# EasyEDA Pro project ProPrj_table-monitor_2025-05-22.epro, board PCB1
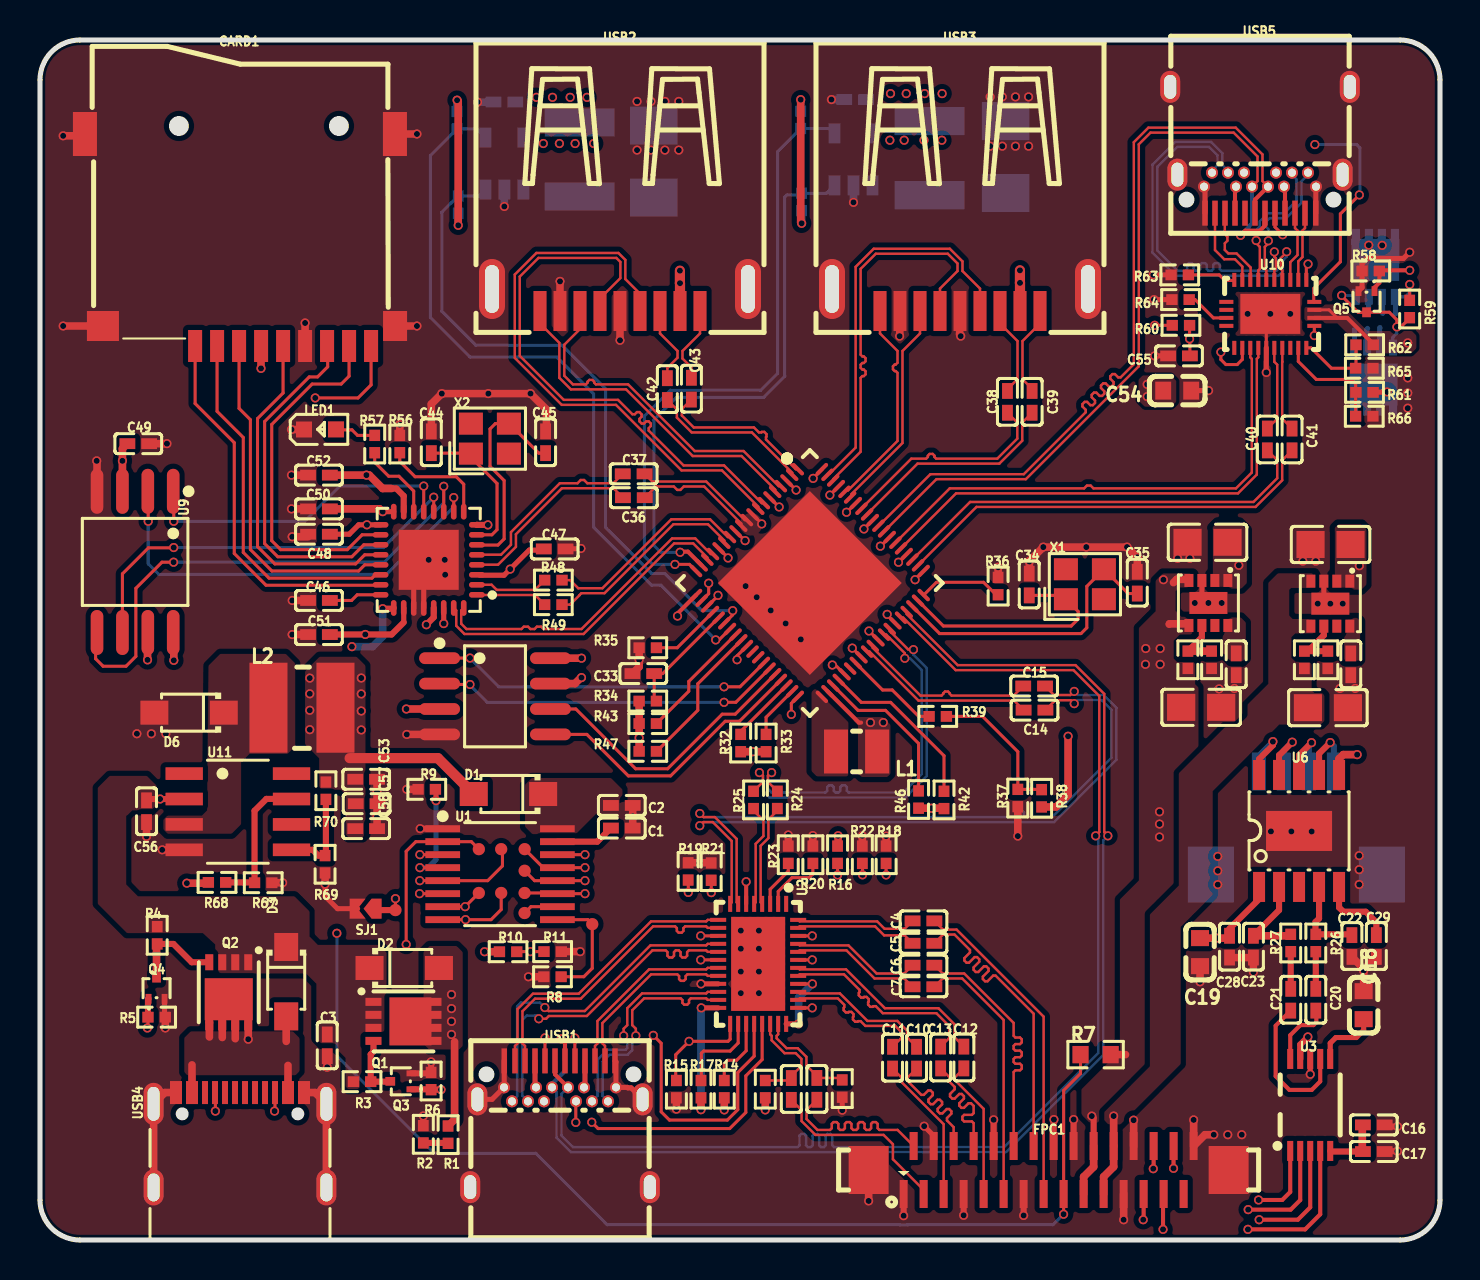
[diagram p5: board, top side]
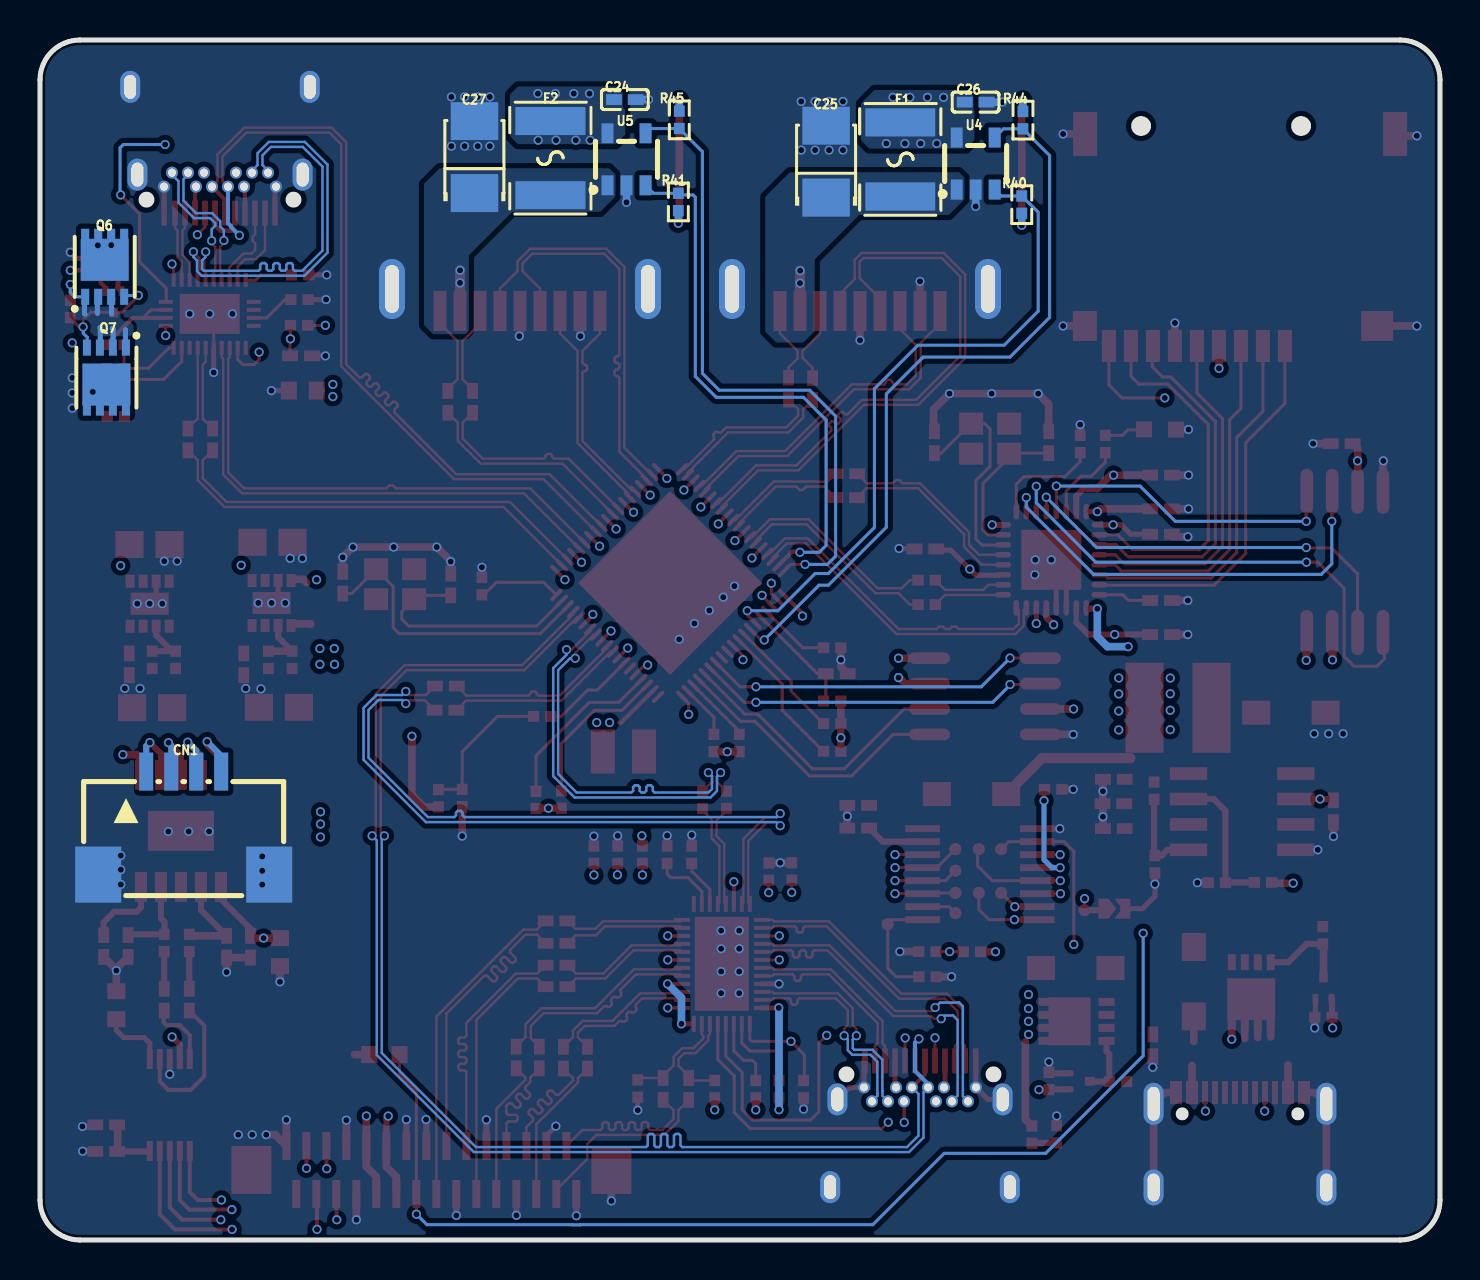
[diagram p6: board, bottom side, seen from below]

Outline 70 x 60 mm; copper layers: Top Layer, GND, VCC, Bottom Layer. Coordinates in mm from the lower left corner of the outline.
Outline path: 0,58 0,2 arc(0.59,0.59) 2,0 68,0 arc(69.41,0.59) 70,2 70,58 arc(69.41,59.41) 68,60 2,60 arc(0.59,59.41) 0,58
Stack: Top Layer 0.035mm 外层铜厚1oz / Dielectric1 0.2104mm 7628 RC49% 8.6mil / GND 0.0152mm 内层铜厚 / Dielectric2 1.065mm 1.1mm H/HOZ Copper / VCC 0.0152mm 内层铜厚 / Dielectric3 0.2104mm 7628 RC49% 8.6mil / Bottom Layer 0.035mm 外层铜厚1oz

## Design rules (mm)
net 0_IN0_P: 0_IN0_
net LANE0_P: LANE0_
net 0_IN0_N: 0_IN0_
net LANE0_N: LANE0_
net 0_IN1_P: 0_IN1_
net LANE1_P: LANE1_
net 0_IN1_N: 0_IN1_
net LANE1_N: LANE1_
net 0_AUX_N: 0_AUX_P
net AUX_N: AUX_
net 0_AUX_P: 0_AUX_P
net AUX_P: AUX_
net 0_IN3_P: 0_IN3_
net LANE3_P: LANE3_
net 0_IN3_N: 0_IN3_
net LANE3_N: LANE3_
net 0_IN2_P: 0_IN2_
net LANE2_P: LANE2_
net 0_IN2_N: 0_IN2_
net LANE2_N: LANE2_
net 0_SSTX_N: 0_SSTX_
net 0_SSTX_P: 0_SSTX_
net SS_TX4_N: SS_TX4_
net SS_TX4_P: SS_TX4_
net SS_TX2_N: SS_TX2_
net SS_TX2_P: SS_TX2_
net SS_TX3_N: SS_TX3_
net SS_TX3_P: SS_TX3_
net SS_TX1_N: SS_TX1_
net SS_TX1_P: SS_TX1_
net SD_D1: SD
net SD_D0: SD
net SD_CLK: SD
net SD_CMD: SD
net SD_D3: SD
net SD_D2: SD
net 0_SSRX_N: 0_SSRX_
net 0_SSRX_P: 0_SSRX_
net SS_RX4_P: SS_RX4_
net SS_RX4_N: SS_RX4_
net C0_TX1_N: C0_TX1_
net C0_TX1_P: C0_TX1_
net C0_RX2_P: C0_RX2_
net C0_RX2_N: C0_RX2_
net C0_RX1_P: C0_RX1_
net C0_RX1_N: C0_RX1_
net C0_TX2_N: C0_TX2_
net C0_TX2_P: C0_TX2_
net SS_HS4_N: SS_HS4_
net SS_HS4_P: SS_HS4_
net C3_RX2_P: C3_RX2_
net C3_RX2_N: C3_RX2_
net C3_RX1_N: C3_RX1_
net C3_RX1_P: C3_RX1_
net C3_TX2_P: C3_TX2_
net C3_TX2_N: C3_TX2_
net C3_TX1_N: C3_TX1_
net C3_TX1_P: C3_TX1_
net SS_HS2_N: SS_HS2_
net SS_HS2_P: SS_HS2_
net SS_HS3_N: SS_HS3_
net SS_HS3_P: SS_HS3_
net C0_DM: U_U2
net C0_DP: U_U2
net SS_HS1_N: SS_HS1_
net SS_HS1_P: SS_HS1_
net 0#SSTX_N: 0#SSTX_
net 0#SSTX_P: 0#SSTX_
net 0#SSRX_N: 0#SSRX_
net 0#SSRX_P: 0#SSRX_
net #SS_TX4_N: #SS_TX4_
net #SS_TX4_P: #SS_TX4_
net #SS_TX2_N: #SS_TX2_
net #SS_TX2_P: #SS_TX2_
net #SS_TX3_N: #SS_TX3_
net #SS_TX3_P: #SS_TX3_
net #SS_TX1_N: #SS_TX1_
net #SS_TX1_P: #SS_TX1_
net #SS_RX4_P: #SS_RX4_
net #SS_RX4_N: #SS_RX4_
net #SS_RX3_P: #SS_RX3_
net #SS_RX3_N: #SS_RX3_
net #SS_RX2_N: #SS_RX2_
net #SS_RX2_P: #SS_RX2_
net #SS_RX1_N: #SS_RX1_
net #SS_RX1_P: #SS_RX1_
template: 自定义配置
spacing copperThickness1oz (default): track to track 0.203, other pairs 0.152 to 0.3
spacing copperThickness2oz: track to track 0.203, other pairs 0.152 to 0.3
track width copperThickness1oz (default): min 0.102, default 0.152, max 2.54
track width copperThickness2oz: min 0.203, default 0.254, max 2.54
differential pair differentialPair (default): width min 0.089, default 0.122, max 2.54; gap min 0.127, default 0.127
via viaSize (default): diameter min 0.457, default 0.457, max 10; hole min 0.3, default 0.305, max 6.299
net GND uses copperThickness2oz

## Placement (name value [footprint] x y rotation side)
C1  1uF  [C0402]  29.09 20.6 180 top
C2  0.1uF  [C0402]  29.09 21.73 180 top
C3  10uF  [C0402]  14.36 9.73 90 top
C4  0.1uF  [C0402]  44.17 15.96 0 top
C5  0.1uF  [C0402]  44.17 14.83 0 top
C6  0.1uF  [C0402]  44.17 13.74 0 top
C7  0.1uF  [C0402]  44.17 12.66 0 top
C8  0.1uF  [C0402]  38.84 7.56 270 top
C9  0.1uF  [C0402]  37.57 7.55 270 top
C10  0.1uF  [C0402]  43.83 9.12 270 top
C11  0.1uF  [C0402]  42.63 9.12 270 top
C12  0.1uF  [C0402]  46.19 9.12 270 top
C13  0.1uF  [C0402]  45.03 9.12 270 top
C14  0.1uF  [C0402]  49.73 26.49 180 top
C15  0.1uF  [C0402]  49.71 27.7 180 top
C16  0.1uF  [C0402]  66.69 5.75 180 top
C17  10uF  [C0402]  66.69 4.42 180 top
C18  10uF  [C0603]  66.18 11.74 270 top
C19  1uF  [C0603]  58 14.39 90 top
C20  10uF  [C0402]  63.79 12.01 90 top
C21  10uF  [C0402]  62.54 12.01 90 top
C22  470pF/NC  [C0402]  65.59 14.7 270 top
C23  470pF/NC  [C0402]  60.67 14.67 90 top
C24  100nF  [C0402]  40.76 57.02 0 bottom
C25  47uF  [CAP-SMD_L3.5-W2.8-FD]  30.7 53.92 90 bottom
C26  100nF  [C0402]  23.22 56.89 0 bottom
C27  47uF  [CAP-SMD_L3.5-W2.8-FD]  48.28 54.15 90 bottom
C28  0.1uF  [C0402]  59.48 14.67 90 top
C29  1uF  [C0402]  66.82 14.7 90 top
C30  3.3nF  [C0402]  65.54 28.78 270 top
C31  22uF  [C0805]  64.39 26.62 180 top
C32  10uF  [C0805]  64.53 34.78 180 top
C33  1uF  [C0402]  30.16 28.32 0 top
C34  20pF  [C0402]  49.46 32.77 90 top
C35  20pF  [C0402]  54.86 32.87 90 top
C36  01.uF  [C0402]  29.69 37.12 0 top
C37  0.1uF  [C0402]  29.68 38.31 0 top
C38  0.1uF  [C0402]  48.37 41.91 90 top
C39  0.1uF  [C0402]  49.6 41.91 90 top
C40  0.1uF  [C0402]  61.37 40.03 90 top
C41  0.1uF  [C0402]  62.6 40.03 90 top
C42  0.1uF  [C0402]  31.37 42.55 270 top
C43  0.1uF  [C0402]  32.57 42.57 270 top
C44  22pF  [C0402]  19.57 39.89 270 top
C45  20pF  [C0402]  25.28 39.89 270 top
C46  0.1uF  [C0402]  13.95 31.98 0 top
C47  0.1uF  [C0402]  25.73 34.55 180 top
C48  0.1uF  [C0402]  13.95 35.29 0 top
C49  0.1uF  [C0402]  4.91 39.82 180 top
C50  0.1uF  [C0402]  13.95 36.56 0 top
C51  4.7uF  [C0402]  13.95 30.27 0 top
C52  2.2uF  [C0402]  13.95 38.24 0 top
C53  0.1uF  [C0402]  16.31 23.04 0 top
C54  1uF  [C0603]  56.86 42.47 180 top
C55  0.1uF  [C0402]  56.95 44.21 0 top
C56  0.1uF  [C0402]  5.33 21.44 90 top
C57  0.1uF  [C0402]  16.33 21.82 180 top
C58  22uF  [C0402]  16.31 20.57 180 top
C59  3.3nF  [C0402]  59.81 28.79 270 top
C60  22uF  [C0805]  58.06 26.63 180 top
C61  10uF  [C0805]  58.38 34.89 0 top
CARD1  TF-01A  [TF-SMD_TF-02]  10 50 180 top
CN1  WAFER-MX1.25-4PCB  [CONN-SMD_4P-P1.25_A1253WR-S-04PD01]  62.81 20.84 180 bottom
D1  S34  [SOD-123FL_L2.7-W1.8-LS3.8-RD]  23.42 22.3 180 top
D2  S34  [SOD-123FL_L2.7-W1.8-LS3.8-RD]  18.21 13.6 0 top
D3  S34  [SOD-123FL_L2.7-W1.8-LS3.8-RD]  12.31 12.92 270 top
D6  S34  [SOD-123FL_L2.7-W1.8-LS3.8-RD]  7.45 26.37 180 top
F1  -  [F1812]  26.98 54.03 270 bottom
F2  -  [F1812]  44.48 54.09 270 bottom
FPC1  AFC11-S30ICA-00  [CONN-SMD-30P_AFC11-S30ICA-00]  50.43 3.5 0 top
L1  4.7uH  [IND-SMD_L2.5-W2.0]  40.83 24.43 180 top
L2  2.2uH  [IND-SMD_L4.5-W4.0_SCD0403T]  13.1 26.61 0 top
LED1  -  [LED_0603]  14.05 40.53 0 top
NOREF  -  [Pad_e954]  21.94 19.54 0 top
NOREF#2  -  [Pad_e956]  24.23 19.54 0 top
NOREF#3  -  [Pad_e958]  24.23 17.35 0 top
NOREF#4  -  [Pad_e960]  23.06 17.35 0 top
NOREF#5  -  [Pad_e961]  21.94 17.35 0 top
NOREF#6  -  [Pad_e962]  17.77 16.5 0 top
NOREF#7  -  [Pad_e955]  23.06 19.54 0 top
NOREF#8  -  [Pad_e957]  24.23 18.46 0 top
NOREF#9  -  [Pad_e959]  24.23 16.35 0 top
NOREF#10  -  [Pad_e997]  27.61 15.79 0 top
Q1  AON7409  [DFN-8_L3.0-W3.0-P0.65-BL]  18.17 10.93 270 top
Q2  AON7409  [DFN-8_L3.0-W3.0-P0.65-BL]  9.44 12.39 180 top
Q3  2SK3541MGT2L  [SOT-723-3_L1.2-W0.8-P0.80-LS1.2-BR]  18.04 7.93 0 top
Q4  2SK3541MGT2L  [SOT-723-3_L1.2-W0.8-P0.80-LS1.2-BR]  5.83 12.59 270 top
Q5  2SK3541MGT2L  [SOT-723-3_L1.2-W0.8-P0.80-LS1.2-BR]  66.33 46.91 90 top
Q6  AON7409  [DFN-8_L3.0-W3.0-P0.65-BL]  66.76 48.66 180 bottom
Q7  AON7409  [DFN-8_L3.0-W3.0-P0.65-BL]  66.68 43.12 0 bottom
R1  NC  [R0402]  20.4 5.27 90 top
R2  NC  [R0402]  19.17 5.29 270 top
R3  100K  [R0402]  16.1 7.92 180 top
R4  100K  [R0402]  5.86 15.24 90 top
R5  10K  [R0402]  5.83 11.14 180 top
R6  10K  [R0402]  19.56 7.95 270 top
R7  1K  [R0603]  52.78 9.27 180 top
R8  10K  [R0402]  25.62 13.16 180 top
R9  NC  [R0402]  19.34 22.53 180 top
R10  36K  [R0402]  23.41 14.41 180 top
R11  12K  [R0402]  25.63 14.42 180 top
R12  1M  [R0402]  36.26 7.54 270 top
R13  1M  [R0402]  40.11 7.57 270 top
R14  10K  [R0402]  34.21 7.54 90 top
R15  10K  [R0402]  31.82 7.54 90 top
R16  10K  [R0402]  39.88 19.26 270 top
R17  10K  [R0402]  33.05 7.54 90 top
R18  20K  [R0402]  42.31 19.26 90 top
R19  0R  [R0402]  32.41 18.43 90 top
R20  20K  [R0402]  38.64 19.26 90 top
R21  0R  [R0402]  33.56 18.42 90 top
R22  0R  [R0402]  41.12 19.26 90 top
R23  0R  [R0402]  37.41 19.26 90 top
R24  0R  [R0402]  36.87 22 90 top
R25  0R  [R0402]  35.68 22 90 top
R26  470R  [R0402]  63.79 14.85 90 top
R27  470R  [R0402]  62.54 14.85 90 top
R30  47K  [R0402]  63.22 29.01 270 top
R31  91K  [R0402]  64.39 29.01 90 top
R32  10K  [R0402]  35.03 24.85 90 top
R33  10K  [R0402]  36.3 24.85 90 top
R34  10K  [R0402]  30.39 26.95 180 top
R35  4.7K  [R0402]  30.39 29.61 0 top
R36  6.04K  [R0402]  47.91 32.7 90 top
R37  10K  [R0402]  48.89 22.1 90 top
R38  4.7K  [R0402]  50.08 22.09 270 top
R39  100K  [R0402]  44.89 26.18 180 top
R40  10K  [R0402]  20.91 51.77 90 bottom
R41  10K  [R0402]  38.08 51.9 90 bottom
R42  10K  [R0402]  43.93 22.02 270 top
R43  10K  [R0402]  30.39 25.82 0 top
R44  10K  [R0402]  20.85 55.99 270 bottom
R45  10K  [R0402]  38.03 56.01 270 bottom
R46  10K  [R0402]  45.2 22 270 top
R47  10K  [R0402]  30.39 24.43 0 top
R48  0R  [R0402]  25.67 32.99 0 top
R49  0R  [R0402]  25.67 31.77 0 top
R56  680R  [R0402]  17.99 39.8 270 top
R57  1K  [R0402]  16.73 39.8 270 top
R58  10K  [R0402]  66.54 48.45 0 top
R59  10K  [R0402]  68.48 46.55 90 top
R60  10K  [R0402]  57.05 45.73 180 top
R61  10K  [R0402]  66.23 42.39 0 top
R62  NC  [R0402]  66.23 44.76 0 top
R63  20.5K  [R0402]  56.99 48.26 180 top
R64  10K  [R0402]  57.03 47.02 180 top
R65  10K  [R0402]  66.22 43.59 180 top
R66  10K  [R0402]  66.21 41.19 180 top
R67  100K  [R0402]  11.16 17.86 180 top
R68  100K  [R0402]  8.85 17.88 180 top
R69  2K  [R0402]  14.25 18.79 90 top
R70  6K2  [R0402]  14.3 22.46 90 top
R71  47K  [R0402]  57.39 29.01 270 top
R72  15K  [R0402]  58.58 29.01 90 top
SJ1  -  [TOGO_MODE]  16.28 16.57 180 top
U1  LDR6023B  [SSOP-16_L5.0-W4.4-P0.65-LS6.4-BL]  23 18.29 270 top
U2  TUSB1064RNQT  [WQFN-40_L6.0-W4.0-P0.40-TL-EP]  35.91 13.81 270 top
U3  CS4344  [TSSOP-10_L3.0-W3.0-P0.50-LS4.9-BL]  63.51 6.75 0 top
U4  SY6288CAAC  [SOT-23-5_L3.0-W1.7-P0.95-LS2.8-BR]  23.22 53.82 270 bottom
U5  SY6288CAAC  [SOT-23-5_L3.0-W1.7-P0.95-LS2.8-BR]  40.67 54.03 270 bottom
U6  LTK5208  [ESOP-10_L4.9-W3.9-P1.00-LS6.1-BL-EP]  62.95 20.45 0 top
U7  TPS82130SILR  [USIP-8_L3.0-W2.8-P0.65-TL-EP]  64.52 31.82 270 top
U8  GL3224-OIY04  [HQFN-32_L5.0-W5.0-P0.50-BL-EP3.0]  19.44 34.01 90 top
U9  W25Q80DVSSIG  [SOIC-8_L5.3-W5.3-P1.27-LS8.0-BL]  4.76 33.9 180 top
U10  VL160  [MQFN-28_L4.5-W3.5-P0.40-BL-EP]  61.52 46.31 180 top
U11  TD1583  [SOP-8_L4.9-W3.9-P1.27-LS6.0-BL]  9.89 21.41 270 top
U13  VL817-Q7(C0)  [QFN-76_L9.0-W9.0-P0.40-EP6.3-TL]  38.49 32.85 315 top
U14  W25Q80DVSSIG  [SOIC-8_L4.9-W3.9-P1.27-LS6.0-BL]  22.75 27.19 270 top
U17  TPS82130SILR  [USIP-8_L3.0-W2.8-P0.65-TL-EP]  58.42 31.85 270 top
USB1  TYPE-C 24P QCHT  [TYPE-C-SMD_TYPE-C-24P-QCHT#2]  26 5.8 0 top
USB2  U-A-39DS-Y-1  [USB-3.0-SMD_U-A-39DS-Y-1]  29 47 180 top
USB3  U-A-39DS-Y-1  [USB-3.0-SMD_U-A-39DS-Y-1]  46 47 180 top
USB4  TYPEC-304A-ACP16O  [USB-SMD_TYPEC-304A-ACP16O]  10 5 0 top
USB5  HX TYPE-C 24P QCHT  [TYPE-C-SMD_TYPE-C-24P-QCHT]  61 54.5 180 top
X1  25MHz  [CRYSTAL-SMD_4P-L2.5-W2.0-BL]  52.25 32.79 0 top
X2  25MHz  [CRYSTAL-SMD_4P-L2.5-W2.0-BL]  22.5 40.07 0 top

## Footprints (pads in the part's own frame, mm; a bottom-side part is the same pattern mirrored in y, then rotated)
C0402
  rect 0.79x0.54 smd: 1(-0.545,0) 2(0.545,0)
C0603
  rect 0.8x0.9 smd: 1(-0.7,0) 2(0.7,0)
C0805
  rect 1.41x1.35 smd: 1(-1,0) 2(1,0)
CAP-SMD_L3.5-W2.8-FD
  rect 1.9x2.376 smd: 1(-1.798,0) 2(1.798,0)
CONN-SMD-30P_AFC11-S30ICA-00
  rect 0.4x1.4 smd: 1(-7.25,-1.2) 2(-6.75,1.2) 3(-6.25,-1.2) 4(-5.75,1.2) 5(-5.25,-1.2) 6(-4.75,1.2) 7(-4.25,-1.2) 8(-3.75,1.2) 9(-3.25,-1.2) 10(-2.75,1.2) 11(-2.25,-1.2) 12(-1.75,1.2) 13(-1.25,-1.2) 14(-0.75,1.2) 15(-0.25,-1.2) 16(0.25,1.2) 17(0.75,-1.2) 18(1.25,1.2) 19(1.75,-1.2) 20(2.25,1.2) 21(2.75,-1.2) 22(3.25,1.2) 23(3.75,-1.2) 24(4.25,1.2) 25(4.75,-1.2) 26(5.25,1.2) 27(5.75,-1.2) 28(6.25,1.2) 29(6.75,-1.2) 30(7.25,1.2)
  rect 2x2.4 smd: 31(9,0) 32(-9,0)
CONN-SMD_4P-P1.25_A1253WR-S-04PD01
  rect 0.7x1.9 smd: 1(-1.875,2.575) 2(-0.625,2.575) 3(0.625,2.575) 4(1.875,2.575)
  rect 2.3x2.8 smd: 5(4.275,-2.575) 6(-4.275,-2.575)
CRYSTAL-SMD_4P-L2.5-W2.0-BL
  rect 1.2x1.1 smd: 1(-0.95,-0.75) 2(0.95,-0.75) 3(0.95,0.75) 4(-0.95,0.75)
DFN-8_L3.0-W3.0-P0.65-BL
  rect 0.4x0.8 smd: 1(-0.975,-1.5) 2(-0.325,-1.5) 3(0.325,-1.5) 4(0.975,-1.5) 5(0.975,1.5) 6(0.325,1.5) 7(-0.325,1.5) 8(-0.975,1.5)
  rect 2.4x2.1 smd: 9(0,0.35)
ESOP-10_L4.9-W3.9-P1.00-LS6.1-BL-EP
  rect 0.6x1.5 smd: 1(-2,-2.8) 2(-1,-2.8) 3(0,-2.8) 4(1,-2.8) 5(2,-2.8) 6(2,2.8) 7(1,2.8) 8(0,2.8) 9(-1,2.8) 10(-2,2.8)
  rect 3.3x2 smd: 11(0,0)
F1812
  rect 1.407x3.499 smd: 1(-1.853,0) 2(1.853,0)
HQFN-32_L5.0-W5.0-P0.50-BL-EP3.0
  oval 0.28x0.785 smd: 1(-1.75,-2.408) 2(-1.25,-2.408) 3(-0.75,-2.408) 4(-0.25,-2.408) 5(0.25,-2.408) 6(0.75,-2.408) 7(1.25,-2.408) 8(1.75,-2.408) 17(1.75,2.408) 18(1.25,2.408) 19(0.75,2.408) 20(0.25,2.408) 21(-0.25,2.408) 22(-0.75,2.408) 23(-1.25,2.408) 24(-1.75,2.408)
  oval 0.785x0.28 smd: 9(2.408,-1.75) 10(2.408,-1.25) 11(2.408,-0.75) 12(2.408,-0.25) 13(2.408,0.25) 14(2.408,0.75) 15(2.408,1.25) 16(2.408,1.75) 25(-2.408,1.75) 26(-2.408,1.25) 27(-2.408,0.75) 28(-2.408,0.25) 29(-2.408,-0.25) 30(-2.408,-0.75) 31(-2.408,-1.25) 32(-2.408,-1.75)
  rect 3x3 smd: 33(0,0)
IND-SMD_L2.5-W2.0
  rect 1.2x2.2 smd: 1(1.028,0) 2(-1.028,0)
IND-SMD_L4.5-W4.0_SCD0403T
  rect 1.9x4.5 smd: 1(-1.675,0) 2(1.675,0)
LED_0603
  rect 0.8x0.8 smd: 1(-0.851,-0.01) 2(0.75,-0.005)
MQFN-28_L4.5-W3.5-P0.40-BL-EP
  rect 0.201x0.701 smd: 1(-1.801,-1.7) 2(-1.399,-1.7) 3(-1.001,-1.7) 4(-0.6,-1.7) 5(-0.201,-1.7) 6(0.201,-1.7) 7(0.6,-1.7) 8(1.001,-1.7) 9(1.399,-1.7) 10(1.801,-1.7) 15(1.801,1.7) 16(1.399,1.7) 17(1.001,1.7) 18(0.6,1.7) 19(0.201,1.7) 20(-0.201,1.7) 21(-0.6,1.7) 22(-1.001,1.7) 23(-1.399,1.7) 24(-1.801,1.7)
  rect 0.701x0.201 smd: 11(2.2,-0.6) 12(2.2,-0.201) 13(2.2,0.201) 14(2.2,0.6) 25(-2.2,0.6) 26(-2.2,0.201) 27(-2.2,-0.201) 28(-2.2,-0.6)
  rect 2.999x1.999 smd: 29(0,0)
Pad_e954
  round 0.61 smd: TP1(0,0)
Pad_e955
  round 0.61 smd: TP2(0,0)
Pad_e956
  round 0.61 smd: TP3(0,0)
Pad_e957
  round 0.61 smd: TP4(0,0)
Pad_e958
  round 0.61 smd: TP5(0,0)
Pad_e959
  round 0.61 smd: TP6(0,0)
Pad_e960
  round 0.61 smd: TP7(0,0)
Pad_e961
  round 0.61 smd: TP8(0,0)
Pad_e962
  round 0.61 smd: TP9(0,0)
Pad_e997
  round 0.61 smd: TP10(0,0)
QFN-76_L9.0-W9.0-P0.40-EP6.3-TL
  oval 0.8x0.2 smd: 1(-4.45,3.599) 2(-4.45,3.2) 3(-4.45,2.799) 4(-4.45,2.401) 5(-4.45,1.999) 6(-4.45,1.6) 7(-4.45,1.199) 8(-4.45,0.8) 9(-4.45,0.399) 10(-4.45,0) 11(-4.45,-0.399) 12(-4.45,-0.8) 13(-4.45,-1.199) 14(-4.45,-1.6) 15(-4.45,-1.999) 16(-4.45,-2.401) 17(-4.45,-2.799) 18(-4.45,-3.2) 19(-4.45,-3.599) 39(4.45,-3.599) 40(4.45,-3.2) 41(4.45,-2.799) 42(4.45,-2.401) 43(4.45,-1.999) 44(4.45,-1.6) 45(4.45,-1.199) 46(4.45,-0.8) 47(4.45,-0.399) 48(4.45,0) 49(4.45,0.399) 50(4.45,0.8) 51(4.45,1.199) 52(4.45,1.6) 53(4.45,1.999) 54(4.45,2.401) 55(4.45,2.799) 56(4.45,3.2) 57(4.45,3.599)
  oval 0.2x0.8 smd: 20(-3.599,-4.45) 21(-3.2,-4.45) 22(-2.799,-4.45) 23(-2.401,-4.45) 24(-1.999,-4.45) 25(-1.6,-4.45) 26(-1.199,-4.45) 27(-0.8,-4.45) 28(-0.399,-4.45) 29(0,-4.45) 30(0.399,-4.45) 31(0.8,-4.45) 32(1.199,-4.45) 33(1.6,-4.45) 34(1.999,-4.45) 35(2.401,-4.45) 36(2.799,-4.45) 37(3.2,-4.45) 38(3.599,-4.45) 58(3.599,4.45) 59(3.2,4.45) 60(2.799,4.45) 61(2.401,4.45) 62(1.999,4.45) 63(1.6,4.45) 64(1.199,4.45) 65(0.8,4.45) 66(0.399,4.45) 67(0,4.45) 68(-0.399,4.45) 69(-0.8,4.45) 70(-1.199,4.45) 71(-1.6,4.45) 72(-1.999,4.45) 73(-2.401,4.45) 74(-2.799,4.45) 75(-3.2,4.45) 76(-3.599,4.45)
  rect 6.5x6.5 smd: 77(0,0)
R0402
  rect 0.566x0.54 smd: 1(-0.433,0) 2(0.433,0)
R0603
  rect 0.806x0.864 smd: 1(-0.753,0) 2(0.753,0)
SOD-123FL_L2.7-W1.8-LS3.8-RD
  rect 1.4x1.2 smd: 1(-1.735,0) 2(1.735,0)
SOIC-8_L4.9-W3.9-P1.27-LS6.0-BL
  oval 0.588x2.045 smd: 1(-1.905,-2.772) 2(-0.635,-2.772) 3(0.635,-2.772) 4(1.905,-2.772) 5(1.905,2.772) 6(0.635,2.772) 7(-0.635,2.772) 8(-1.905,2.772)
SOIC-8_L5.3-W5.3-P1.27-LS8.0-BL
  oval 0.63x2.25 smd: 1(-1.905,-3.53) 2(-0.635,-3.53) 3(0.635,-3.53) 4(1.905,-3.53) 5(1.905,3.53) 6(0.635,3.53) 7(-0.635,3.53) 8(-1.905,3.53)
SOP-8_L4.9-W3.9-P1.27-LS6.0-BL
  rect 0.63x1.865 smd: 1(-1.905,-2.683) 2(-0.635,-2.683) 3(0.635,-2.683) 4(1.905,-2.683) 5(1.905,2.683) 6(0.635,2.683) 7(-0.635,2.683) 8(-1.905,2.683)
SOT-23-5_L3.0-W1.7-P0.95-LS2.8-BR
  rect 1x0.6 smd: 1(1.3,-0.95) 2(1.3,0) 3(1.3,0.95) 4(-1.3,0.95) 5(-1.3,-0.95)
SOT-723-3_L1.2-W0.8-P0.80-LS1.2-BR
  rect 0.489x0.294 smd: 1(0.529,-0.4) 2(0.529,0.4)
  rect 0.489x0.434 smd: 3(-0.529,0)
SSOP-16_L5.0-W4.4-P0.65-LS6.4-BL
  rect 0.343x1.732 smd: 1(-2.275,-2.866) 2(-1.625,-2.866) 3(-0.975,-2.866) 4(-0.325,-2.866) 5(0.325,-2.866) 6(0.975,-2.866) 7(1.625,-2.866) 8(2.275,-2.866) 9(2.275,2.866) 10(1.625,2.866) 11(0.975,2.866) 12(0.325,2.866) 13(-0.325,2.866) 14(-0.975,2.866) 15(-1.625,2.866) 16(-2.275,2.866)
TF-SMD_TF-02
  rect 0.7x1.6 smd: 1(2.245,5.3) 2(1.145,5.3) 3(0.046,5.3) 4(-1.054,5.3) 5(-2.155,5.3) 6(-3.255,5.3) 7(-4.354,5.3) 8(-5.454,5.3) 9(-6.554,5.3)
  rect 1.2x1.5 smd: 10(-7.754,4.3)
  rect 1.2x2.2 smd: 11(-7.746,-5.3) 12(7.754,-5.3)
  rect 1.6x1.5 smd: 13(6.854,4.3)
TOGO_MODE
  custom 0.901x1 smd: 1(-0.35,0)
  custom 0.8x1 smd: 2(0.4,0)
TSSOP-10_L3.0-W3.0-P0.50-LS4.9-BL
  rect 0.299x1 smd: 1(-1,-2.3) 2(-0.5,-2.3) 3(0,-2.3) 4(0.5,-2.3) 5(1,-2.3) 6(1,2.3) 7(0.5,2.3) 8(0,2.3) 9(-0.5,2.3) 10(-1,2.3)
TYPE-C-SMD_TYPE-C-24P-QCHT
  oval 1x1.6 hole 0.6x1.2: 25(-4.49,-3.158) 25(-4.13,1.232) 25(4.13,1.232) 25(4.49,-3.158)
  rect 0.275x1.25 smd: A1(-2.79,3.158) A2(-2.25,3.158) A3(-1.75,3.158) A4(-1.25,3.158) A5(-0.75,3.158) A6(-0.25,3.158) A7(0.25,3.158) A8(0.75,3.158) A9(1.25,3.158) A10(1.75,3.158) A11(2.25,3.158) A12(2.75,3.158)
  round 0.6 hole 0.4: B1(2.8,1.833) B2(2.4,1.133) B3(1.601,1.133) B4(1.2,1.833) B5(0.8,1.133) B6(0.4,1.833) B7(-0.4,1.833) B8(-0.8,1.133) B9(-1.2,1.833) B10(-1.6,1.133) B11(-2.4,1.133) B12(-2.8,1.833)
TYPE-C-SMD_TYPE-C-24P-QCHT#2
  oval 1.001x1.6 hole 0.6x1.199: 25(-4.49,-3.157) 25(-4.13,1.232) 25(4.13,1.232) 25(4.49,-3.157)
  rect 0.275x1.25 smd: A1(-2.789,3.157) A2(-2.251,3.157) A3(-1.75,3.157) A4(-1.25,3.157) A5(-0.75,3.157) A6(-0.249,3.157) A7(0.249,3.157) A8(0.75,3.157) A9(1.25,3.157) A10(1.75,3.157) A11(2.251,3.157) A12(2.751,3.157)
  round 0.6 hole 0.399: B1(2.799,1.831) B2(2.401,1.133) B3(1.6,1.133) B4(1.199,1.831) B5(0.8,1.133) B6(0.402,1.831) B7(-0.399,1.831) B8(-0.8,1.133) B9(-1.199,1.831) B10(-1.6,1.133) B11(-2.401,1.133) B12(-2.799,1.831)
USB-3.0-SMD_U-A-39DS-Y-1
  rect 0.65x2 smd: 1(-3,0.55) 2(-1,0.55) 3(1,0.55) 4(3,0.55) 5(4,0.55) 6(2,0.55) 7(0,0.55) 8(-2,0.55) 9(-4,0.55)
  oval 1.3x3 hole 0.7x2.4: 10(-6.4,-0.55) 11(6.4,-0.55)
USB-SMD_TYPEC-304A-ACP16O
  oval 1x2.1 hole 0.6x1.7: 12(-4.32,1.808) 13(4.32,1.808)
  oval 1x1.8 hole 0.6x1.4: 14(-4.32,-2.373) 15(4.32,-2.373)
  rect 0.6x1.15 smd: A1B12(-3.2,2.373) A4B9(-2.4,2.373) B1A12(3.2,2.373) B4A9(2.4,2.373)
  rect 0.3x1.15 smd: A5(-1.25,2.373) A6(-0.25,2.373) A7(0.25,2.373) A8(1.25,2.373) B5(1.75,2.373) B6(0.75,2.373) B7(-0.75,2.373) B8(-1.75,2.373)
USIP-8_L3.0-W2.8-P0.65-TL-EP
  rect 0.65x0.45 smd: 1(-1.125,0.975) 2(-1.125,0.325) 3(-1.125,-0.325) 4(-1.125,-0.975) 5(1.125,-0.975) 6(1.125,-0.325) 7(1.125,0.325) 8(1.125,0.975)
  rect 1.1x1.9 smd: 9(0,0)
WQFN-40_L6.0-W4.0-P0.40-TL-EP
  rect 0.8x0.2 smd: 1(-3,1.4) 2(-3,1) 3(-3,0.6) 4(-3,0.2) 5(-3,-0.201) 6(-3,-0.6) 7(-3,-1) 8(-3,-1.4) 21(3,-1.4) 22(3,-1) 23(3,-0.6) 24(3,-0.2) 25(3,0.2) 26(3,0.6) 27(3,1) 28(3,1.4)
  rect 0.2x0.8 smd: 9(-2.2,-2) 10(-1.8,-2) 11(-1.401,-2) 12(-1,-2) 13(-0.6,-2) 14(-0.2,-2) 15(0.2,-2) 16(0.6,-2) 17(1,-2) 18(1.4,-2) 19(1.8,-2) 20(2.2,-2) 29(2.2,2) 30(1.8,2) 31(1.4,2) 32(1,2) 33(0.6,2) 34(0.2,2) 35(-0.2,2) 36(-0.6,2) 37(-1,2) 38(-1.4,2) 39(-1.8,2) 40(-2.2,2)
  rect 4.7x2.7 smd: 41(0,0)

## Nets
As in the schematic, except:
GND: C1.1 C2.1 C3.1 C16.1 C17.1 C18.1 C19.1 C22.2 C23.1 C24.1 C25.2 C26.1 C27.2 C28.1 C29.1 C30.2 C31.1 C32.2 C33.1 C34.2 C35.2 C44.1 C45.1 C46.1 C47.1 C48.1 C49.1 C50.1 C51.1 C52.1 C53.2 C54.1 C55.1 C56.1 C57.1 C58.1 C59.2 C60.1 C61.1 CARD1.6 CARD1.10 CARD1.11 CARD1.12 CARD1.13 CN1.5 CN1.6 D6.2 FPC1.1 FPC1.4 FPC1.7 FPC1.10 FPC1.13 FPC1.16 FPC1.18 FPC1.23 FPC1.24 FPC1.30 FPC1.31 FPC1.32 LED1.1 Q3.2 Q4.2 Q5.2 R2.1 R5.1 R6.1 R8.2 R9.2 R11.1 R13.2 R15.1 R18.2 R19.2 R20.2 R21.2 R22.2 R23.2 R31.1 R35.1 R36.2 R37.1 R56.1 R58.1 R63.2 R64.2 R65.1 R66.1 R67.1 R69.1 R72.1 SJ1.2 U1.1 U2.17 U2.41 U3.8 U4.2 U5.2 U6.11 U7.3 U7.9 U8.27 U8.28 U8.33 U9.4 U10.19 U10.29 U11.4 U13.77 U14.4 U17.3 U17.9 USB1.25 USB1.A1 USB1.A12 USB1.B1 USB1.B12 USB2.4 USB2.7 USB2.10 USB2.11 USB3.4 USB3.7 USB3.10 USB3.11 USB4.12 USB4.13 USB4.14 USB4.15 USB4.A1B12 USB4.B1A12 USB5.25 USB5.A1 USB5.A12 USB5.B1 USB5.B12
V33S: C19.2 C28.2 C60.2 FPC1.19 FPC1.20 R7.1 R12.2 R14.1 R16.1 R17.1 R32.1 R33.1 R34.2 R40.1 R41.1 R42.2 R43.1 R44.1 R45.1 R46.2 R47.1 R71.2 U2.6 U2.20 U2.28 U2.32 U3.9 U6.1 U6.6 U17.4 U17.5
5_10W_CHOEN: NOREF#10.TP10 R8.1 U1.9
C0_CC1: NOREF#4.TP7 U1.8 USB1.A5
C0_CC2: NOREF#5.TP8 U1.7 USB1.B5
C0_VBUS_EN: NOREF.TP1 Q3.1 R6.2 U1.2
C1_ADC/DET: NOREF#3.TP5 R10.1 R11.2 U1.11
C1_CC1: NOREF#2.TP3 U1.13 USB4.A5
C1_CC2: NOREF#8.TP4 U1.12 USB4.B5
C1_VBUS_EN: NOREF#7.TP2 Q4.1 R5.2 U1.5
IIS_D0: FPC1.28 U3.1
IIS_MCLK: FPC1.27 U3.4
IIS_SCLK: FPC1.26 U3.2
IIS_WS: FPC1.25 U3.3
L_O: C21.1 U3.7
NS_LED: NOREF#9.TP6 U1.10
NS_OUTPUT: NOREF#6.TP9 SJ1.1 U1.6
R_O: C20.1 U3.10
$2N1296: C16.2 C17.2 U3.5
$2N1395: C18.2 U3.6

Pads without a net: U2 1; U6 3; U7 7; U10 11 12 14 15 22; U11 1 6 8; U13 30 31 44; U17 7; USB4 A6 A7 A8 B6 B7 B8; USB5 A8 B8; X1 2 4; X2 2 4

## Via types
v1: diameter 0.457, hole 0.305, Top Layer to Bottom Layer, 358 vias

## Routing (per net, layer and track width the routed paths; a pad name or vN(x,y) marks a point on that pad's centre or on a via; arc(x,y) is an arc through that point)
GND: length 125.9
  Top Layer w0.152: U10.19 61.31,46.11 v1(61.52,46.31)
  Top Layer w0.254: C54.1 v1(58.43,42.47) ; U2.17 v1(33.05,12.81) ; 28.75,8.96 28.8,8.91 USB1.B1 29.37,7.63 29.39,7.61 29.56,7.61 USB1.25 ; R13.2 v1(40.11,6.49) ; 26.36,34.56 27.04,34.56 v1(27.05,34.58) ; U7.3 64.19,32.14 v1(64.52,31.82) ; USB5.B12 63.79,52.66 USB5.A1 ; U17.3 58.09,32.18 v1(58.42,31.85) ; 19.19,33.76 18.69,33.26 U8.27 ; 19.19,33.76 v1(19.44,34.01) ; 19.19,33.76 U8.28 ; R64.2 v1(55.7,47.02) ; R5.1 6.23,11.18 Q4.2 ; U3.8 v1(63.51,8.29) ; C55.1 v1(55.73,44.21) ; 68.48,49.39 68.18,49.08 66.36,49.08 66.1,48.83 66.1,47.62 Q5.2 ; R63.2 v1(55.66,48.26) ; SJ1.2 14.87,16.57 14.25,17.19 v1(14.25,17.79) ; U10.19 v1(61.31,43.38) ; v1(44.21,5.69) 44.68,5.22 FPC1.4 ; 23.21,8.96 23.21,7.64 USB1.B12 22.6,7.03 USB1.25 ; USB5.A12 58.25,52.62 USB5.B1
  Top Layer w0.305: v1(67.88,5.68) 67.41,5.68 67.4,5.69 ; v1(50.7,6.02) 50.68,6.01 FPC1.16 ; U1.1 v1(19.01,20.57) ; v1(19.56,8.91) R6.1 19.51,8.34 18.57,8.34 ; R2.1 v1(19.17,6.2) ; 67.15,4.44 v1(67.87,4.44) ; FPC1.10 v1(47.68,6.01) ; FPC1.7 v1(46.18,1.23) ; FPC1.13 v1(49.18,1.23) ; FPC1.1 v1(43.18,1.21) ; FPC1.18 v1(51.68,6.02)
  Top Layer w0.381: 46.06,45.21 45.98,45.29 45.98,46.56 ; USB4.14 USB4.12 6.25,7.37 USB4.A1B12 ; USB2.7 v1(29,44.99) ; v1(57.68,6.01) FPC1.30 58.25,5.26 v1(58.69,5.26) ; R36.2 v1(47.91,33.64) ; R5.1 v1(6.26,10.6) ; R23.2 v1(37.41,20.25) ; R22.2 v1(41.12,20.21) ; C33.1 29.96,28.66 v1(29.96,29.01) R35.1 ; C50.1 v1(12.57,36.56) ; C53.2 v1(16.85,22.44) v1(16.85,21.16) C58.1 ; C44.1 19.57,41.8 v1(20.09,42.32) v1(22.42,42.32) v1(24.53,42.32) 25.32,41.53 25.32,40.46 25.3,40.43 ; USB2.4 v1(26,47.93) ; C19.1 v1(58,12.91) ; 17.99,40.23 v1(17.99,40.77) ; U11.4 v1(6.11,19.51) ; R9.2 18.34,22.53 ; FPC1.23 v1(54.18,1.01) ; 42.99,46.18 42.99,45.2 v1(42.98,45.19) ; 66.18,13.52 66.18,13.56 C22.2 ; 66.18,13.52 v1(66.18,13.47) C18.1 ; 66.18,13.52 C29.1 ; C2.1 v1(29.64,21.19) C1.1 ; FPC1.32 v1(41.43,1.95) ; R69.1 v1(14.25,17.79) ; CARD1.13 1.14,45.7 ; C28.1 C23.1 v1(60.67,13.39) ; v1(18.34,25.28) 18.34,25.28 U14.4 ; CARD1.6 v1(13.25,45.85) ; LED1.1 v1(12.57,40.52) ; 31.82,7.11 v1(31.82,6.54) ; FPC1.24 v1(54.68,5.99) ; C49.1 v1(6.35,39.82) ; 32.41,18.86 v1(32.99,18.86) 33.55,18.86 R21.2 ; C52.1 v1(12.57,38.24) ; C3.1 v1(14.36,8.63) ; R67.1 v1(12.13,17.86) ; USB4.B1A12 13.75,7.37 USB4.13 USB4.15 ; R37.1 v1(48.89,20.2) ; v1(2.83,38.96) 2.85,38.94 U9.4 ; R11.1 v1(27.01,14.42) ; 13.4,35.16 12.57,35.16 ; CARD1.12 2.16,55.21 v1(1.16,55.21) ; C51.1 12.57,30.27 ; CARD1.10 18.62,45.7 ; C35.2 v1(54.86,34.14) v1(54.35,34.65) v1(52.31,34.65) v1(50.16,34.65) 49.47,33.95 v1(49.47,33.92) 49.47,33.32 C34.2 ; CARD1.11 v1(18.85,55.3) ; C46.1 v1(12.61,31.98) ; R20.2 v1(38.64,20.22) ; C56.1 v1(5.33,20.18) ; R18.2 v1(42.31,20.19) ; R8.2 v1(24.42,13.16)
  Bottom Layer w0.381: 40.21,57.02 v1(39.57,57.02) ; C26.1 v1(21.88,56.89) ; U5.2 v1(40.67,51.88) ; U4.2 v1(23.22,51.68)
  vias: v1(1.16,45.7) v1(4.84,25.31) v1(5.57,25.31) v1(6.29,25.31) v1(12.61,35.16) v1(12.61,30.27) v1(18.34,22.53) v1(18.85,45.7) v1(20.24,34.01) v1(20.26,33.26) v1(29.85,56.93) v1(29.85,54.5) v1(30.55,56.93) v1(30.55,54.5) v1(31.24,56.93) v1(31.24,54.5) v1(31.94,56.93) v1(31.94,54.5) v1(35.04,15.47) v1(35.04,14.56) v1(35.04,13.42) v1(35.04,12.34) v1(35.28,32.69) v1(35.84,32.14) v1(35.94,15.47) v1(35.94,14.56) v1(35.94,13.42) v1(35.94,12.34) v1(36.54,31.48) v1(37.28,30.83) v1(38.04,30.03) v1(46.04,45.19) v1(47.51,57.16) v1(47.51,54.69) v1(48.11,57.16) v1(48.11,54.69) v1(48.77,57.16) v1(48.77,54.69) v1(49.43,57.16) v1(49.43,54.69) v1(56.88,34.08) v1(57.49,34.08) v1(57.74,31.85) v1(58.89,19.18) v1(58.89,18.46) v1(58.89,17.77) v1(58.96,27.56) v1(59.09,31.85) v1(59.39,5.26) v1(59.72,27.58) v1(60.09,5.26) v1(60.38,46.31) v1(61.55,20.43) v1(62.51,46.31) v1(62.57,20.43) v1(63.14,33.94) v1(63.58,20.42) v1(63.79,33.94) v1(63.89,31.82) v1(65,27.58) v1(65.14,31.82) v1(65.76,27.58) v1(65.96,19.22) v1(65.96,18.52) v1(65.96,17.78) v1(68.39,43.11) v1(68.39,42.35) v1(68.39,41.59) v1(68.49,49.39)
V33S: length 132
  Top Layer w0.152: U2.32 v1(38.62,12.81)
  Top Layer w0.203: U2.6 v1(35.31,17.91)
  Top Layer w0.254: U2.28 v1(37.93,10.81) ; U2.20 v1(33.06,11.61)
  Top Layer w0.305: U6.1 60.95,17.04 59.48,15.57 C28.2 ; FPC1.20 52.68,6.1 v1(52.59,6.2) ; U3.9 63.01,9.77 v1(63.39,10.15)
  Top Layer w0.381: 34.21,7.11 v1(34.21,6.51) ; 57.39,30.81 56.48,30.81 56.46,30.79 ; R34.2 R43.1 v1(29.96,25.11) R47.1 ; R42.2 v1(44.58,21.59) 45.18,21.59 R46.2 ; C19.2 v1(58.82,15.09) 59.36,15.09 C28.2 ; v1(20.85,56.99) 20.91,56.93 v1(20.91,50.73) ; R7.1 54.28,9.27 ; 36.3,24.42 v1(35.64,24.42) 35.03,24.42 ; 56.67,32.87 56.84,33.03 57.32,33.03 ; v1(39.91,20.21) 39.91,19.72 R16.1 ; 33.05,7.11 v1(33.05,6.51) ; FPC1.20 52.68,3.66 52.18,3.16 FPC1.19 ; v1(38.03,57.02) 38.03,50.88 v1(38.08,50.83) ; U6.6 64.95,24.06 65.16,24.27 v1(65.86,24.27) ; 36.26,7.11 v1(36.26,6.51)
  VCC w0.305: v1(39.91,20.21) 39.21,19.52 35.88,19.52 35.31,18.95 v1(35.31,17.91) 35.31,17.12 36.64,15.79 36.64,12.53 37.93,11.25 v1(37.93,10.81)
  VCC w0.381: v1(38.08,50.83) 38.1,50.85 49.37,50.85 50.91,49.32 50.91,39.39 56.17,34.12 v1(56.17,33.01) ; v1(20.85,56.99) 22.38,58.52 37.3,58.52 38.03,57.79 v1(38.03,57.02)
  VCC w0.457: v1(55.98,20.8) 60.65,20.8 ; v1(55.98,21.41) 60.76,21.41 ; v1(29.96,25.11) 29.96,22.16 ; 35.05,22.11 35.05,23.82 v1(35.64,24.42) ; v1(55.98,20.15) 60.72,20.15
  Bottom Layer w0.381: v1(33.05,6.51) 33.05,11.59 v1(33.06,11.61) ; R41.1 v1(38.08,50.83) ; v1(38.62,12.81) 37.93,12.12 v1(37.93,10.81) ; 20.85,56.42 v1(20.85,56.99) ; 20.91,51.33 v1(20.91,50.73) ; R45.1 v1(38.03,57.02)
  vias: v1(55.29,29.57) v1(55.27,28.78) v1(56.01,29.57) v1(56.01,28.78)
VBUS2: length 2
  Top Layer w0.508: USB3.1 v1(49,47.86) 49,47.86 v1(49,48.48)
VCC: length 2
  Top Layer w0.508: USB2.1 v1(32,47.84) 32,47.85 v1(32,48.47)
0#SSRX_N: length 5.1
  Top Layer w0.122: R24.1 36.87,21.47 36.42,21.02 36.42,20.09 36.03,19.71 36.03,16.88 U2.4
0#SSRX_P: length 5.2
  Top Layer w0.122: 35.68,21.57 35.68,21.47 36.17,20.97 36.17,20.2 35.78,19.81 35.78,16.88 U2.5
0#SSTX_N: length 34.2
  Top Layer w0.122: v1(32.99,21.33) 33.16,21.16 33.17,21.16 33.19,21.14 33.74,21.14 34.83,20.06 34.83,16.88 U2.7 ; v1(51.71,26.82) 51.54,26.99 50.76,26.99 C14.1
  Bottom Layer w0.122: v1(32.99,21.33) 33.17,21.14 48.79,21.14 48.87,21.23 48.87,21.37 48.96,21.46 49.11,21.46 49.2,21.37 49.2,21.23 49.29,21.14 50.61,21.14 53.57,24.11 53.57,26.5 53.08,27 51.89,27 v1(51.71,26.82)
0#SSTX_P: length 34.2
  Top Layer w0.122: U2.8 34.58,16.88 34.58,19.95 33.64,20.9 33.19,20.9 33.17,20.88 33.16,20.88 v1(32.99,20.72) ; v1(51.71,27.43) 51.69,27.43 51.51,27.25 50.7,27.25 50.25,27.7
  Bottom Layer w0.122: v1(32.99,20.72) 33,20.72 33.19,20.9 50.71,20.9 53.82,24.01 53.82,26.61 53.18,27.25 51.89,27.25 v1(51.71,27.43)
0_AUX_N: length 9.4
  Top Layer w0.122: C8.2 38.33,6.5 38.33,6.05 38.87,5.5 39.5,5.5 39.59,5.59 39.59,5.81 39.68,5.89 39.83,5.89 39.92,5.81 39.92,5.59 40,5.5 40.16,5.5 40.24,5.59 40.24,5.81 40.33,5.89 40.49,5.89 40.57,5.81 40.57,5.59 40.66,5.5 40.81,5.5 40.9,5.59 40.9,5.81 40.99,5.89 41.14,5.89 41.23,5.81 41.23,5.59 41.31,5.5 41.47,5.5 41.56,5.59 41.56,5.81 41.64,5.89 41.8,5.89 41.88,5.81 41.88,5.59 41.97,5.5 42.88,5.5 FPC1.2
0_AUX_P: length 9.4
  Top Layer w0.122: FPC1.3 44.18,2.5 42.65,4.04 42.65,4.79 42.18,5.25 38.77,5.25 38.08,5.94 38.08,6.49 C9.2
0_IN0_N: length 16.2
  Top Layer w0.122: FPC1.14 49.68,11.31 47.78,13.22 47.66,13.22 47.38,12.94 47.25,12.94 47.14,13.05 47.14,13.17 47.43,13.45 47.43,13.57 47.32,13.68 47.19,13.68 46.91,13.4 46.79,13.4 46.68,13.51 46.68,13.63 46.96,13.91 46.96,14.03 46.85,14.14 46.73,14.14 46.45,13.86 46.33,13.86 46.22,13.97 46.22,14.09 46.5,14.38 46.5,14.5 45.73,15.27 45.15,15.27 C5.2
0_IN0_P: length 16.3
  Top Layer w0.122: FPC1.15 50.18,11.17 45.83,15.52 45.15,15.52 C4.2
0_IN1_N: length 13.2
  Top Layer w0.122: FPC1.11 48.18,11 46.11,13.08 45.13,13.08 C7.2
0_IN1_P: length 13.1
  Top Layer w0.122: FPC1.12 48.68,8.4 48.77,8.48 49,8.48 49.09,8.57 49.09,8.73 49,8.81 48.77,8.81 48.68,8.9 48.68,9.05 48.77,9.14 49,9.14 49.09,9.23 49.09,9.38 49,9.47 48.77,9.47 48.68,9.55 48.68,9.71 48.77,9.8 49,9.8 49.09,9.88 49.09,10.04 49,10.12 48.77,10.12 48.68,10.21 48.68,10.85 46.21,13.33 45.13,13.33 C6.2
0_IN2_N: length 7.1
  Top Layer w0.122: C13.2 45.49,8.12 45.49,7.9 45.73,7.66 45.73,7.53 45.5,7.3 45.5,7.18 45.61,7.07 45.73,7.07 45.96,7.3 46.09,7.3 46.2,7.19 46.2,7.07 45.96,6.84 45.96,6.72 46.07,6.61 46.2,6.61 46.43,6.84 46.55,6.84 46.68,6.71 46.68,6.34 46.6,6.26 46.21,6.26 46.12,6.17 46.12,6.01 46.21,5.93 46.6,5.93 46.68,5.84 FPC1.8
0_IN2_P: length 7.1
  Top Layer w0.122: FPC1.9 47.18,6.56 45.74,8 45.74,8.12 C12.2
0_IN3_N: length 7.3
  Top Layer w0.122: C11.2 43.1,8.09 43.1,7.87 45.18,5.79 FPC1.5
0_IN3_P: length 7.3
  Top Layer w0.122: C10.2 43.35,8.09 43.35,7.97 44.07,7.26 44.19,7.26 44.41,7.47 44.53,7.47 44.64,7.37 44.64,7.24 44.42,7.02 44.42,6.9 44.53,6.79 44.65,6.79 44.87,7.01 44.99,7.01 45.1,6.9 45.1,6.78 44.89,6.56 44.89,6.44 45,6.33 45.12,6.33 45.34,6.55 45.46,6.55 45.57,6.44 45.57,6.32 45.35,6.1 45.35,5.98 45.68,5.64 FPC1.6
0_POL: length 18.5
  Top Layer w0.152: U2.21 34.51,10.04 34.4,9.93 v1(32.45,9.93) 31.79,9.26 31.79,8.01 R15.2 ; 25.87,19.27 27.22,19.27
  VCC w0.254: v1(27.25,19.27) 27.29,19.23 28.29,19.23 28.97,18.55 28.97,14.44 32.45,10.95 v1(32.45,9.93)
0_SEL: length 4.4
  Top Layer w0.152: U2.22 34.91,9.85 34.51,9.45 33.17,9.45 33.07,9.34 33.07,7.99 R17.2
0_SSRX_N: length 19.3
  Top Layer w0.122: v1(43.24,29.09) 43.24,29.34 42.47,30.11 42.47,30.11 42.31,30.27 U13.50 ; v1(36.58,23.37) 36.55,23.37 36.4,23.22 36.4,22.91 R24.2
  Bottom Layer w0.122: v1(36.58,23.37) 36.4,23.19 36.4,22.56 36.58,22.37 39.27,22.37 39.36,22.46 39.36,22.65 39.45,22.73 39.6,22.73 39.69,22.65 39.69,22.46 39.77,22.37 39.93,22.37 40.01,22.46 40.01,22.65 40.1,22.73 40.26,22.73 40.34,22.65 40.34,22.46 40.43,22.37 43.17,22.37 44.09,23.3 44.09,28.49 43.51,29.08 43.49,29.08 43.48,29.09 v1(43.24,29.09)
0_SSRX_P: length 19.3
  Top Layer w0.122: v1(43.67,29.52) 43.66,29.53 43.41,29.53 42.58,30.36 42.57,30.36 42.49,30.44 U13.51 ; R25.2 36.15,22.91 36.15,23.22 36,23.37 v1(35.97,23.37)
  Bottom Layer w0.122: v1(35.97,23.37) 35.97,23.36 36.15,23.17 36.15,22.45 36.48,22.13 43.27,22.13 44.34,23.2 44.34,28.59 43.68,29.25 43.68,29.27 43.67,29.28 v1(43.67,29.52)
0_SSTX_N: length 9
  Top Layer w0.122: C14.2 48.7,26.97 43.92,26.97 41.47,29.42 U13.47
0_SSTX_P: length 9
  Top Layer w0.122: C15.2 48.68,27.22 45.58,27.22 45.49,27.31 45.49,27.34 45.4,27.42 45.25,27.42 45.16,27.34 45.16,27.31 45.08,27.22 44.03,27.22 41.64,29.61 U13.48
1_USBOC: length 33.2
  Top Layer w0.152: v1(34.63,31.47) 34.63,31.25 U13.25
  Bottom Layer w0.152: U4.3 21.94,52.2 R40.2 20.56,51.85 20.55,51.85 20.09,51.39 20.09,46.44 21.79,44.74 26.1,44.74 28.28,42.56 28.28,35.63 30.58,33.32 31.24,33.32 33.1,31.47 v1(34.63,31.47)
1_USBPE: length 37.4
  Top Layer w0.152: U13.26 33.95,30 v1(33.79,30)
  Bottom Layer w0.152: v1(33.79,30) 31.05,32.74 30.58,32.74 27.68,35.64 27.68,42.3 25.84,44.14 21.5,44.14 19.52,46.13 19.52,54.23 R44.2 21.83,55.56 U4.4
2_4L_CHOEN: length 5.6
  Top Layer w0.152: U1.4 v1(18.99,18.62)
  Top Layer w0.254: R9.1 19.8,22.51 v1(19.8,21.97)
  Bottom Layer w0.254: v1(18.99,18.62) 19.4,18.62 19.8,19.02 v1(19.8,21.97)
2_USBOC: length 28.2
  Top Layer w0.203: 32,34.42 32.4,34.42 U13.18
  Bottom Layer w0.152: U5.3 39.32,52.33 38.08,52.33 38,52.25 37.34,52.25 37.24,52.14 37.24,43.18 36.19,42.13 31.82,42.13 30.69,41 30.69,34.73 31.04,34.39 v1(32,34.39)
2_USBPE: length 31.9
  Top Layer w0.152: 32.8,33.45 32.47,33.78 31.75,33.78
  Bottom Layer w0.152: v1(31.75,33.78) 30.63,33.78 30.22,34.19 30.22,41.19 31.51,42.49 36.04,42.49 36.88,43.33 36.88,54.42 R45.2 39.48,55.57 U5.4
3_USBOC: length 7.8
  Top Layer w0.152: U13.41 40.9,26.48 42.28,26.48 43.93,24.83 43.93,22.45
3_USBPE: length 8.6
  Top Layer w0.152: U13.42 41.06,26.88 42.53,26.88 45.2,24.21 R46.1
4_USBOC: length 6.1
  Top Layer w0.152: U13.27 32.44,27.93 32.44,27.44 R43.2
4_USBPE: length 7.3
  Top Layer w0.152: U13.28 32.89,27.81 32.89,26.49 30.84,24.43 R47.2
5_10W_CHOEN: length 5.8
  Top Layer w0.152: R8.1 27.19,13.16 27.61,13.59 NOREF#10.TP10 27.39,16.02 25.87,16.02
7911_V12: length 4.1
  Top Layer w0.381: FPC1.21 53.18,3.16 53.68,3.66 FPC1.22 v1(53.68,6.2)
#SS_RX1_N: length 17
  Top Layer w0.122: USB2.5 25,45.82 25.97,44.86 25.97,43.11 26.54,42.53 29.3,42.53 32.64,39.2 35.08,39.2 36.76,37.52 36.76,37.41
#SS_RX1_P: length 16.9
  Top Layer w0.122: 37.04,37.69 36.94,37.69 35.18,39.45 32.74,39.45 29.41,42.78 27.79,42.78 27.71,42.87 27.71,42.92 27.62,43 27.47,43 27.38,42.92 27.38,42.87 27.29,42.78 26.65,42.78 26.22,43.21 26.22,44.76 27,45.55 USB2.6
#SS_RX2_N: length 10.8
  Top Layer w0.122: 40.22,37.41 40.3,37.48 40.4,37.48 42.88,39.95 42.88,43.36 42.79,43.45 42.73,43.45 42.65,43.53 42.65,43.69 42.73,43.77 42.79,43.77 42.88,43.86 42.88,44.45 42,45.33 USB3.5
#SS_RX2_P: length 10.8
  Top Layer w0.122: 40.51,37.13 40.58,37.2 40.58,37.31 43.12,39.85 43.12,44.45 44,45.33 USB3.6
#SS_RX3_N: length 25.7
  Top Layer w0.122: U10.17 60.51,44.13 60.59,44.06 60.59,38.37 59.8,37.58 52.67,37.58 52.53,37.72 52.35,37.72 52.21,37.58 45.49,37.58 U13.63
#SS_RX3_P: length 25.7
  Top Layer w0.122: U10.18 60.92,44.13 60.84,44.06 60.84,38.27 59.9,37.33 45.8,37.33 U13.62
#SS_RX4_N: length 10.2
  Top Layer w0.122: U13.14 34.21,34.97 33.4,35.79 31.67,35.79 28.23,32.34 27.07,32.34 26.98,32.25 26.98,32.25 26.5,31.77 R49.2
#SS_RX4_P: length 10.4
  Top Layer w0.122: R48.2 26.5,32.99 26.91,32.59 28.12,32.59 31.57,36.04 33.5,36.04 34.39,35.15 U13.13
#SS_TX1_N: length 8.1
  Top Layer w0.122: 37.61,38.26 37.61,38.36 35.59,40.38 32.58,40.38 31.84,41.12 31.84,41.52 C42.2
#SS_TX1_P: length 8.1
  Top Layer w0.122: C43.2 32.09,41.55 32.09,41.22 32.69,40.63 35.7,40.63 35.95,40.38 36.07,40.38 36.09,40.4 36.21,40.4 36.32,40.3 36.32,40.17 36.3,40.15 36.3,40.03 37.78,38.54 U13.1
#SS_TX2_N: length 11
  Top Layer w0.122: 41.06,36.57 43.57,39.07 44.31,39.07 44.39,39.15 44.39,39.22 44.48,39.3 44.64,39.3 44.72,39.22 44.72,39.15 44.81,39.07 47.86,39.07 48.86,40.07 48.86,40.87 C38.1
#SS_TX2_P: length 11
  Top Layer w0.122: C39.1 49.11,40.87 49.11,39.97 47.97,38.82 43.87,38.82 41.29,36.23 41.29,36.18
#SS_TX3_N: length 21.5
  Top Layer w0.122: U13.60 46.5,36.9 60.67,36.9 61.86,38.09 61.86,38.99 C40.1
#SS_TX3_P: length 21.7
  Top Layer w0.122: U13.59 46.82,36.65 60.78,36.65 62.11,37.99 62.11,38.99 C41.1
#SS_TX4_N: length 6.1
  Top Layer w0.122: C36.2 30.8,37.67 31.69,37.67 31.86,37.51 32.02,37.51 32.19,37.67 33.21,37.67 35.06,35.82 U13.11
#SS_TX4_P: length 6.1
  Top Layer w0.122: C37.2 30.61,37.92 33.31,37.92 35.24,36 U13.10
AUX_N: length 5.2
  Top Layer w0.122: R13.1 40.01,8.1 C8.1 38.84,8.2 38.32,8.73 38.32,9.16 37.89,9.59 37.33,9.59 36.83,10.09 36.83,10.21 36.91,10.28 U2.27
AUX_P: length 5.2
  Top Layer w0.122: R12.1 37.44,7.97 C9.1 37.57,8.2 38.07,8.71 38.07,9.05 37.78,9.34 37.23,9.34 36.58,9.98 36.58,10.21 36.51,10.28 U2.26
BUS_5V: length 32.1
  Top Layer w0.152: R60.2 v1(55.73,45.73) ; v1(37.57,26.28) 37.57,26.83 U13.38 ; U10.27 64.45,46.51 64.85,46.11
  Top Layer w0.203: 63.72,46.11 65.36,46.11 66.69,44.78 R62.2 ; v1(31.88,31.2) 31.88,31.32 U13.20
  Top Layer w0.254: v1(67.36,42.4) 67.35,42.39 66.73,42.39
  Top Layer w0.305: U8.15 18.19,37.2 17.81,37.58 17.57,37.58
  Top Layer w0.381: 17.57,37.58 17.13,37.58 16.46,38.24 C52.2 ; v1(51.4,25.19) 51.4,22.25 50.81,21.65 R38.2
  Top Layer w0.508: 15.48,24.09 19.89,24.09 D1.2
  VCC w0.305: 68.32,44.88 67.36,43.91 67.36,42.37
  VCC w0.508: v1(31.88,31.2) 31.88,27.22
  vias: v1(13.49,28.1) v1(13.49,27.31) v1(13.49,26.49) v1(13.49,25.52) v1(16.06,28.1) v1(16.06,27.3) v1(16.06,26.45) v1(16.06,25.5) v1(16.32,38.24) v1(24.82,57.13) v1(25.17,54.82) v1(25.63,57.13) v1(25.97,54.82) v1(26.51,57.13) v1(26.76,54.82) v1(27.35,57.13) v1(27.69,54.82) v1(42.53,57.32) v1(42.49,54.99) v1(43.21,54.99) v1(43.31,57.32) v1(44.23,57.32) v1(44.2,54.99) v1(45.11,57.32) v1(45.09,54.99) v1(55.36,42.78) v1(55.36,42.17) v1(59.94,33.73) v1(65.97,33.71) v1(68.39,44.86)
C0_ADC/DET: length 1.2
  Top Layer w0.305: 19.17,4.85 20.38,4.85 R1.1
C0_CC1: length 12.7
  Top Layer w0.152: NOREF#4.TP7 23.06,16.52 22.55,16.02 v1(21.28,16.02) U1.8 ; v1(25.25,10.11) USB1.A5
  VCC w0.152: v1(21.28,16.02) 21.28,14.08 v1(25.25,10.11)
C0_CC2: length 22.4
  Top Layer w0.152: NOREF#5.TP8 v1(21.26,16.67) 20.14,16.67 ; 26.8,6.93 26.79,6.92 v1(26.79,5.88)
  VCC w0.152: v1(26.79,5.88) 26,5.09 21.71,5.09 21.14,5.67 21.14,8.28 18.72,10.7 18.72,14.13 v1(21.26,16.67)
C0_DM: length 66.1
  Top Layer w0.122: v1(53.39,20.21) 53.22,20.38 53.22,20.39 53.21,20.4 53.21,27.31 51.77,28.74 45.88,28.74 43.34,31.29 U13.54
  Top Layer w0.203: 26.25,8.96 26.25,9.86 v1(26.05,10.06)
  Bottom Layer w0.122: v1(53.39,20.21) 53.16,19.98 53.16,9.25 48.31,4.4 26.55,4.4 25.83,5.12 25.83,7.41 USB1.B7
  Bottom Layer w0.203: v1(26.05,10.06) 26.25,9.86 26.25,8.45 25.6,7.8 USB1.B7
C0_DP: length 66
  Top Layer w0.122: v1(52.78,20.21) 52.95,20.38 52.95,20.39 52.96,20.4 52.96,27.2 51.67,28.49 45.78,28.49 43.16,31.12 U13.53
  Top Layer w0.203: USB1.B6 25.75,8.28 25.75,8.96
  Bottom Layer w0.122: v1(52.78,20.21) 52.91,20.08 52.91,9.35 48.2,4.65 39.7,4.65 39.61,4.73 39.61,5.22 39.53,5.3 39.37,5.3 39.28,5.22 39.28,4.73 39.2,4.65 39.04,4.65 38.96,4.73 38.96,5.22 38.87,5.3 38.72,5.3 38.63,5.22 38.63,4.73 38.54,4.65 38.39,4.65 38.3,4.73 38.3,5.22 38.22,5.3 38.06,5.3 37.97,5.22 37.97,4.73 37.89,4.65 26.65,4.65 26.07,5.22 26.07,7.31 USB1.B6
C0_RX1_N: length 16.6
  Top Layer w0.122: U2.13 33.39,14.41 33.31,14.48 32.44,14.48 32.36,14.4 32.36,14.21 32.27,14.12 32.11,14.12 32.03,14.21 32.03,14.4 31.94,14.48 31.79,14.48 31.7,14.4 31.7,14.21 31.61,14.12 31.46,14.12 31.37,14.21 31.37,14.4 31.29,14.48 30.62,14.48 27.34,11.2 25.44,11.2 25.31,11.06 v1(24.94,11.06)
  Bottom Layer w0.122: 24.4,6.93 24.12,7.21 24.12,11 24.34,11.22 24.78,11.22 v1(24.94,11.06)
C0_RX1_P: length 16.6
  Top Layer w0.122: U2.12 33.39,14.81 33.31,14.73 30.52,14.73 27.24,11.45 25.43,11.45 25.25,11.62 v1(25.24,11.62)
  Bottom Layer w0.122: v1(25.24,11.62) 24.99,11.87 24.04,11.87 23.86,11.69 23.86,7.19 23.6,6.93
C0_RX2_N: length 9.2
  Top Layer w0.122: 27.75,8.96 27.75,9.7 27.88,9.83 27.88,9.95 27.87,9.96 27.87,10.95 30.45,13.53 33.31,13.53 33.39,13.61 U2.15
C0_RX2_P: length 9.2
  Top Layer w0.122: 28.25,8.96 28.25,9.7 28.12,9.83 28.12,10.05 28.12,10.06 28.12,10.85 30.56,13.28 31.87,13.28 31.95,13.2 31.95,13.04 32.04,12.96 32.2,12.96 32.28,13.04 32.28,13.2 32.37,13.28 33.31,13.28 33.39,13.21 U2.16
C0_SBU1: length 18.5
  Top Layer w0.152: v1(30.66,10.23) 31.06,9.84 31.06,6.41 31.47,6 34.37,6 34.89,6.52 34.89,8.37 35.71,9.19 U2.24 ; v1(26.74,10.1) 26.74,8.96 26.75,8.96
  VCC w0.152: v1(26.74,10.1) 27.24,9.61 30.31,9.61 30.66,9.96 v1(30.66,10.23)
C0_SBU2: length 15.9
  Top Layer w0.152: U2.25 36.11,9.02 35.29,8.21 35.29,6.38 34.49,5.57 27.9,5.57 v1(27.59,5.89)
  VCC w0.152: 25.2,6.93 25.2,6.74 25.6,6.35 27.13,6.35 v1(27.59,5.89)
C0_TX1_N: length 14.5
  Top Layer w0.122: U2.10 33.39,15.61 33.31,15.68 32.26,15.68 32.17,15.6 32.17,15.45 32.08,15.37 31.93,15.37 31.84,15.45 31.84,15.6 31.76,15.68 30.66,15.68 27.04,12.07 24.75,12.07 24.12,11.44 24.12,9.83 24.25,9.7 24.25,8.96
C0_TX1_P: length 14.5
  Top Layer w0.122: U2.9 33.39,16.01 33.31,15.93 30.55,15.93 26.94,12.31 24.65,12.31 23.88,11.54 23.88,9.83 23.75,9.7 23.75,8.96
C0_TX2_N: length 11
  Top Layer w0.122: v1(29.18,10.21) 29.18,10.56 29.36,10.74 29.36,11.59 30.1,12.33 33.31,12.33 33.39,12.41 U2.18
  Bottom Layer w0.122: 27.6,6.93 27.88,7.21 27.88,7.43 27.88,7.44 27.88,9.02 28.37,9.51 29.28,9.51 29.36,9.59 29.36,10.02 29.18,10.2 v1(29.18,10.21)
C0_TX2_P: length 11
  Top Layer w0.122: U2.19 33.39,12.01 33.31,12.08 32.54,12.08 32.45,12 32.45,11.86 32.36,11.77 32.21,11.77 32.12,11.86 32.12,12 32.04,12.08 30.21,12.08 29.61,11.49 29.61,10.74 29.79,10.56 v1(29.79,10.21)
  Bottom Layer w0.122: v1(29.79,10.21) 29.61,10.03 29.61,9.49 29.38,9.26 28.47,9.26 28.13,8.92 28.13,7.34 28.12,7.33 28.12,7.21 28.4,6.93
C0_VBUS: length 11
  Top Layer w0.254: USB1.B9 24.75,7.68 24.75,8.96 ; USB1.B4 27.25,7.68 27.25,8.96
  Top Layer w0.381: R1.2 20.73,6.03 20.73,9.91
  VCC w0.457: USB1.B4 27.2,8.27 26.84,8.63 25.16,8.63 24.8,8.27 USB1.B9
  vias: v1(20.57,12.27) v1(20.57,11.57) v1(20.57,10.93) v1(20.57,10.28)
C0_VBUS_EN: length 18.1
  Top Layer w0.152: NOREF.TP1 21.57,19.92 U1.2 18.79,19.92 18.31,19.43 v1(18.31,14.78)
  Top Layer w0.305: Q3.1 19.54,7.53 R6.2 v1(20.05,7.52)
  VCC w0.152: v1(20.05,7.52) 18.31,9.26 v1(18.31,14.78)
C1_ADC/DET: length 9.7
  Top Layer w0.152: R11.2 v1(24.52,14.42) 23.84,14.42 R10.1 ; NOREF#3.TP5 25.83,17.35 25.87,17.32 v1(27.25,17.32)
  VCC w0.152: v1(27.25,17.32) 25.06,17.32 24.52,16.77 v1(24.52,14.42)
C1_CC1: length 32
  Top Layer w0.152: v1(8.77,6.45) 8.77,7.35 USB4.A5 ; v1(27.25,18.62) 25.16,18.62 NOREF#2.TP3
  VCC w0.152: v1(27.25,18.62) 21.2,18.62 18.83,16.25 17.98,16.25 17.35,15.62 17.35,9.85 16.58,9.09 10.11,9.09 8.77,7.75 v1(8.77,6.45)
C1_CC2: length 28.3
  Top Layer w0.152: USB4.B5 11.75,6.44 11.73,6.42 ; 27.23,17.97 24.73,17.97 NOREF#8.TP4
  VCC w0.152: 11.73,6.42 11.73,7.39 12.52,8.18 16.55,8.18 17.85,9.48 17.85,15.1 18.47,15.71 19.08,15.71 21.34,17.97 v1(27.25,17.97)
  vias: v1(11.73,6.45)
C1_VBUS: length 22.1
  Top Layer w0.381: USB4.A4B9 7.6,8.75 ; Q2.7 9.76,10.07 ; USB4.B4A9 12.4,8.73 ; Q2.5 8.47,10.88 8.47,10.15 ; R10.2 v1(22.23,14.41) ; Q2.8 v1(10.41,10.04) ; D3.2 12.31,9.93 ; Q2.6 9.11,10.12
  GND w0.508: v1(10.41,10.04) 10.41,10.94 12.42,12.94 17.95,12.94 19.42,14.41 v1(22.23,14.41)
C1_VBUS_EN: length 28.7
  Top Layer w0.152: R5.2 5.4,10.6 5.37,10.57 ; v1(18.99,17.97) 22.38,17.97 23.12,18.71 23.12,19.48 NOREF#7.TP2
  Top Layer w0.305: 5.43,12.06 5.4,12.03 R5.2
  VCC w0.152: v1(18.99,17.97) 17.69,17.97 16.9,17.17 16.9,10.13 16.35,9.58 5.97,9.58 5.37,10.18 5.37,10.57
  vias: v1(5.37,10.6)
C3_CC1: length 4.4
  Top Layer w0.152: v1(63.4,48.8) 63.32,48.71 63.32,48 ; v1(62.13,50.26) 61.75,50.65 USB5.A5
  VCC w0.152: v1(62.13,50.26) 62.66,50.26 63.4,49.52 v1(63.4,48.8)
C3_CC2: length 15.7
  Top Layer w0.152: 63.69,46.9 63.69,47.58 65.02,48.91 65.02,51.31 v1(65.97,52.25)
  VCC w0.152: 60.22,53.32 60.19,53.36 60.19,54.48 60.48,54.77 v1(63.74,54.77)
  Bottom Layer w0.152: v1(63.74,54.77) 65.83,54.77 66,54.61 66,52.37
C3_RX1_N: length 6.9
  Top Layer w0.122: v1(60.81,49.98) 60.81,49.84 60.99,49.66 60.99,48.55 60.92,48.48 60.92,48
  Bottom Layer w0.122: v1(60.81,49.98) 60.81,50.49 60.99,50.68 60.99,50.94 61.39,51.34 62.2,51.34 62.83,51.97 62.83,53.04 62.6,53.26 USB5.B10
C3_RX1_P: length 6.9
  Top Layer w0.122: v1(61.42,49.96) 61.42,49.83 61.24,49.66 61.24,48.55 61.31,48.48 61.31,48
  Bottom Layer w0.122: USB5.B11 63.4,53.26 63.07,52.94 63.07,51.87 62.3,51.09 61.5,51.09 61.24,50.84 61.24,50.72 61.42,50.54 v1(61.42,49.96)
C3_RX2_N: length 4.2
  Top Layer w0.122: USB5.A10 59.24,51.33 59.24,50.29 59.37,50.16 59.37,49.96 59.24,49.83 59.24,49.5 59.42,49.33 59.83,49.33 60.53,48.62 60.53,48.02 60.51,48
C3_RX2_P: length 4.2
  Top Layer w0.122: 60.12,48 60.12,48.67 59.75,49.04 59.21,49.04 58.75,49.5 USB5.A11
C3_TX1_N: length 3.5
  Top Layer w0.122: 62.52,48 62.52,48.89 62.88,49.25 62.88,50.47 62.75,50.6 USB5.A3
C3_TX1_P: length 3.5
  Top Layer w0.122: 62.92,48 62.92,48.94 63.12,49.15 63.12,50.47 63.25,50.6 USB5.A2
C3_TX2_N: length 19.4
  Top Layer w0.122: 62.12,48 62.12,48.48 62.04,48.55 62.04,49.1 62.33,49.39 v1(62.33,49.41)
  Bottom Layer w0.122: v1(62.33,49.41) 62.33,49.16 62.15,48.98 62.15,48.44 61.92,48.21 56.78,48.21 55.62,49.37 55.62,53.77 56.76,54.9 58.56,54.9 59.12,54.34 59.12,53.75 59.4,53.47 USB5.B3
C3_TX2_P: length 19.4
  Top Layer w0.122: 61.72,48 61.72,48.48 61.79,48.55 61.79,49.1 61.72,49.17 v1(61.72,49.41)
  Bottom Layer w0.122: v1(61.72,49.41) 61.72,49.16 61.9,48.97 61.9,48.55 61.81,48.46 59.08,48.46 58.99,48.55 58.99,48.76 58.91,48.85 58.75,48.85 58.66,48.76 58.66,48.55 58.58,48.46 58.42,48.46 58.34,48.55 58.34,48.76 58.25,48.85 58.09,48.85 58.01,48.76 58.01,48.55 57.92,48.46 57.77,48.46 57.68,48.55 57.68,48.76 57.59,48.85 57.44,48.85 57.35,48.76 57.35,48.55 57.27,48.46 56.88,48.46 55.87,49.47 55.87,53.67 56.86,54.65 58.45,54.65 58.87,54.23 58.87,53.75 58.6,53.47 USB5.B2
C3_VBUS: length 7
  Top Layer w0.203: USB5.B4 59.75,52.62 USB5.A9 ; USB5.B9 62.25,52.62 USB5.A4
  VCC w0.508: USB5.B4 59.8,51.97 60.29,51.48 61.82,51.48 62.2,51.86 USB5.B9
  vias: v1(66.44,49.74) v1(67.11,49.73)
CE: length 8.3
  Top Layer w0.152: 57.5,44.21 57.5,45.04 v1(57.48,45.06) R60.1 ; v1(63.72,45.22) U10.25
  VCC w0.152: v1(63.72,45.22) 63.55,45.06 v1(57.48,45.06)
DP_HPD: length 62.4
  Top Layer w0.152: v1(51.18,1.29) 51.18,1.29 FPC1.17 51.18,7.48 52.03,8.32 R7.2 ; U1.3 v1(18.99,19.27)
  VCC w0.152: v1(14.84,15.34) 14.84,16.97 17.14,19.27 v1(18.99,19.27)
  Bottom Layer w0.152: v1(51.18,1.29) 50.66,0.77 43.38,0.77 43.37,0.76 42.99,0.76 42.98,0.77 28.36,0.77 24.79,4.33 19.72,4.33 14.84,9.21 v1(14.84,15.34)
DPEQ0/A1: length 7.2
  Top Layer w0.152: R18.1 v1(42.31,18.25) ; U2.35 v1(38.61,14.01)
  VCC w0.254: v1(38.61,14.01) 38.78,14.01 39.47,14.7 39.47,15.41 v1(42.31,18.25)
DPEQ1: length 3.2
  Top Layer w0.152: U2.2 36.91,16.81 36.91,17.43 37.6,18.12 38.46,18.12 38.64,18.3 R20.1
EQ0: length 3.9
  Top Layer w0.152: v1(33.56,17.37) 33.56,17.98 R21.1 ; U2.11 v1(33.03,15.21)
  VCC w0.254: v1(33.56,17.37) 33.56,15.74 v1(33.03,15.21)
EQ1: length 5.1
  Top Layer w0.152: R19.1 32.41,17.99 v1(32.41,17.38) ; U2.14 33.03,14.01
  VCC w0.254: v1(32.41,17.38) 32.41,14.63 v1(33.03,14.01)
GL_1V2: length 14.6
  Top Layer w0.254: 25.24,34.49 24.46,34.49 v1(23.51,33.55) 23.2,33.24 21.99,33.24 ; U8.17 v1(16.35,35.76) 15.93,35.76 15.46,35.29 C48.2
  VCC w0.381: v1(23.51,33.55) 22.37,33.55 20.15,35.76 v1(16.35,35.76)
GL_3V3: length 29.4
  Top Layer w0.254: U8.16 17.12,36.42 ; U8.30 v1(20.19,30.82)
  Top Layer w0.305: U8.25 17.65,31.56 v1(17.13,31.56) ; U8.8 21.85,35.76 v1(22.39,35.76)
  Top Layer w0.381: 17.12,36.42 16.98,36.56 C50.2 ; U9.3 v1(4.12,38.96) 4.12,39.57 C49.2 ; U9.7 5.38,30.36 v1(5.38,29.01) ; U9.8 6.69,30.35 v1(6.69,28.98)
  VCC w0.381: v1(22.39,35.76) 21.47,35.76 20.81,36.42 v1(17.13,36.42) 16.07,36.42 15.69,36.04 15.69,33.01 v1(17.13,31.56) 19.84,31.56 20.19,31.21 v1(20.19,30.82)
  Bottom Layer w0.381: v1(15.59,29.67) 16.63,29.67 17.13,30.17 v1(17.13,31.56)
GL_XI: length 10.8
  Top Layer w0.152: U8.6 21.86,34.75 22.9,34.75 23.21,35.06 23.21,37.97 22.5,38.68 22.5,40.55 22.77,40.82 X2.3 23.46,40.82 24.94,39.34 C45.2
GL_XO: length 7.4
  Top Layer w0.152: U8.7 22.59,35.26 22.85,35.52 22.85,37.83 21.54,39.13 21.54,39.32 21.52,39.34 C44.2
IIS_D0: length 10.4
  Top Layer w0.203: FPC1.28 56.68,4.69 v1(56.68,3.58) ; U3.1 62.51,2.4 62.11,2 v1(60.93,2)
  VCC w0.203: v1(56.68,3.58) 56.68,2.69 57.36,2 v1(60.93,2)
IIS_MCLK: length 13.1
  Top Layer w0.203: U3.4 64.01,1.29 63.26,0.53 v1(60.4,0.53) ; v1(56.15,0.53) 56.15,2.27 FPC1.27
  VCC w0.203: v1(60.4,0.53) v1(56.15,0.53)
IIS_SCLK: length 12.7
  Top Layer w0.203: v1(60.41,1.52) 62.53,1.52 63.01,2 U3.2 ; v1(55.66,3.56) 55.68,3.58 FPC1.26
  VCC w0.203: v1(55.66,3.56) 55.66,2.41 56.56,1.52 v1(60.41,1.52)
IIS_WS: length 12.7
  Top Layer w0.203: FPC1.25 55.18,1.04 v1(55.16,1.01) ; v1(60.96,1.01) 62.89,1.01 63.51,1.63 U3.3
  VCC w0.203: v1(60.96,1.01) v1(55.16,1.01)
L_IN: length 4.9
  Top Layer w0.305: C23.2 61.95,16.49 U6.2
  Top Layer w0.381: R27.2 62.46,15.21 C23.2
L_O: length 7.4
  Top Layer w0.203: U3.7 64.01,7.93 63.59,7.51 62.47,7.51 61.78,8.19 61.78,10.72 C21.1
LANE0_N: length 6.1
  Top Layer w0.122: C5.1 43.23,15.23 42.21,15.23 41.76,15.68 37.98,15.68 U2.39
LANE0_P: length 6.1
  Top Layer w0.122: U2.40 37.98,15.93 41.86,15.93 42.23,15.56 43.23,15.56 C4.1
LANE1_N: length 6.5
  Top Layer w0.122: U2.36 37.98,14.48 40.32,14.48 41.73,13.08 43.21,13.08 C7.1
LANE1_P: length 6.5
  Top Layer w0.122: C6.1 43.21,13.33 41.83,13.33 40.43,14.73 37.98,14.73 U2.37
LANE2_N: length 10.3
  Top Layer w0.122: U2.33 37.98,13.28 40.2,13.28 40.97,12.51 40.97,12.39 40.94,12.35 40.94,12.23 41.05,12.12 41.17,12.12 41.21,12.15 41.33,12.15 41.44,12.04 41.44,11.92 41.41,11.89 41.41,11.77 41.51,11.66 41.64,11.66 41.67,11.69 41.79,11.69 42.14,11.34 44.82,11.34 45.46,10.7 45.46,10.1 C13.1
LANE2_P: length 10.3
  Top Layer w0.122: U2.34 37.98,13.53 40.3,13.53 42.24,11.59 44.92,11.59 45.73,10.78 45.73,10.13 C12.1
LANE3_N: length 7.3
  Top Layer w0.122: U2.30 37.98,12.08 39.89,12.08 40.21,11.76 40.21,11.64 40.18,11.61 40.18,11.49 40.29,11.38 40.42,11.38 40.44,11.41 40.57,11.41 40.68,11.3 40.68,11.17 40.65,11.15 40.65,11.02 40.76,10.91 40.88,10.91 40.91,10.94 41.03,10.94 41.27,10.71 42.76,10.71 43.1,10.36 43.1,10.14 42.63,9.66
